# EAGLE design GrrCON-Badge-Rev1 (EAGLE 6.4)
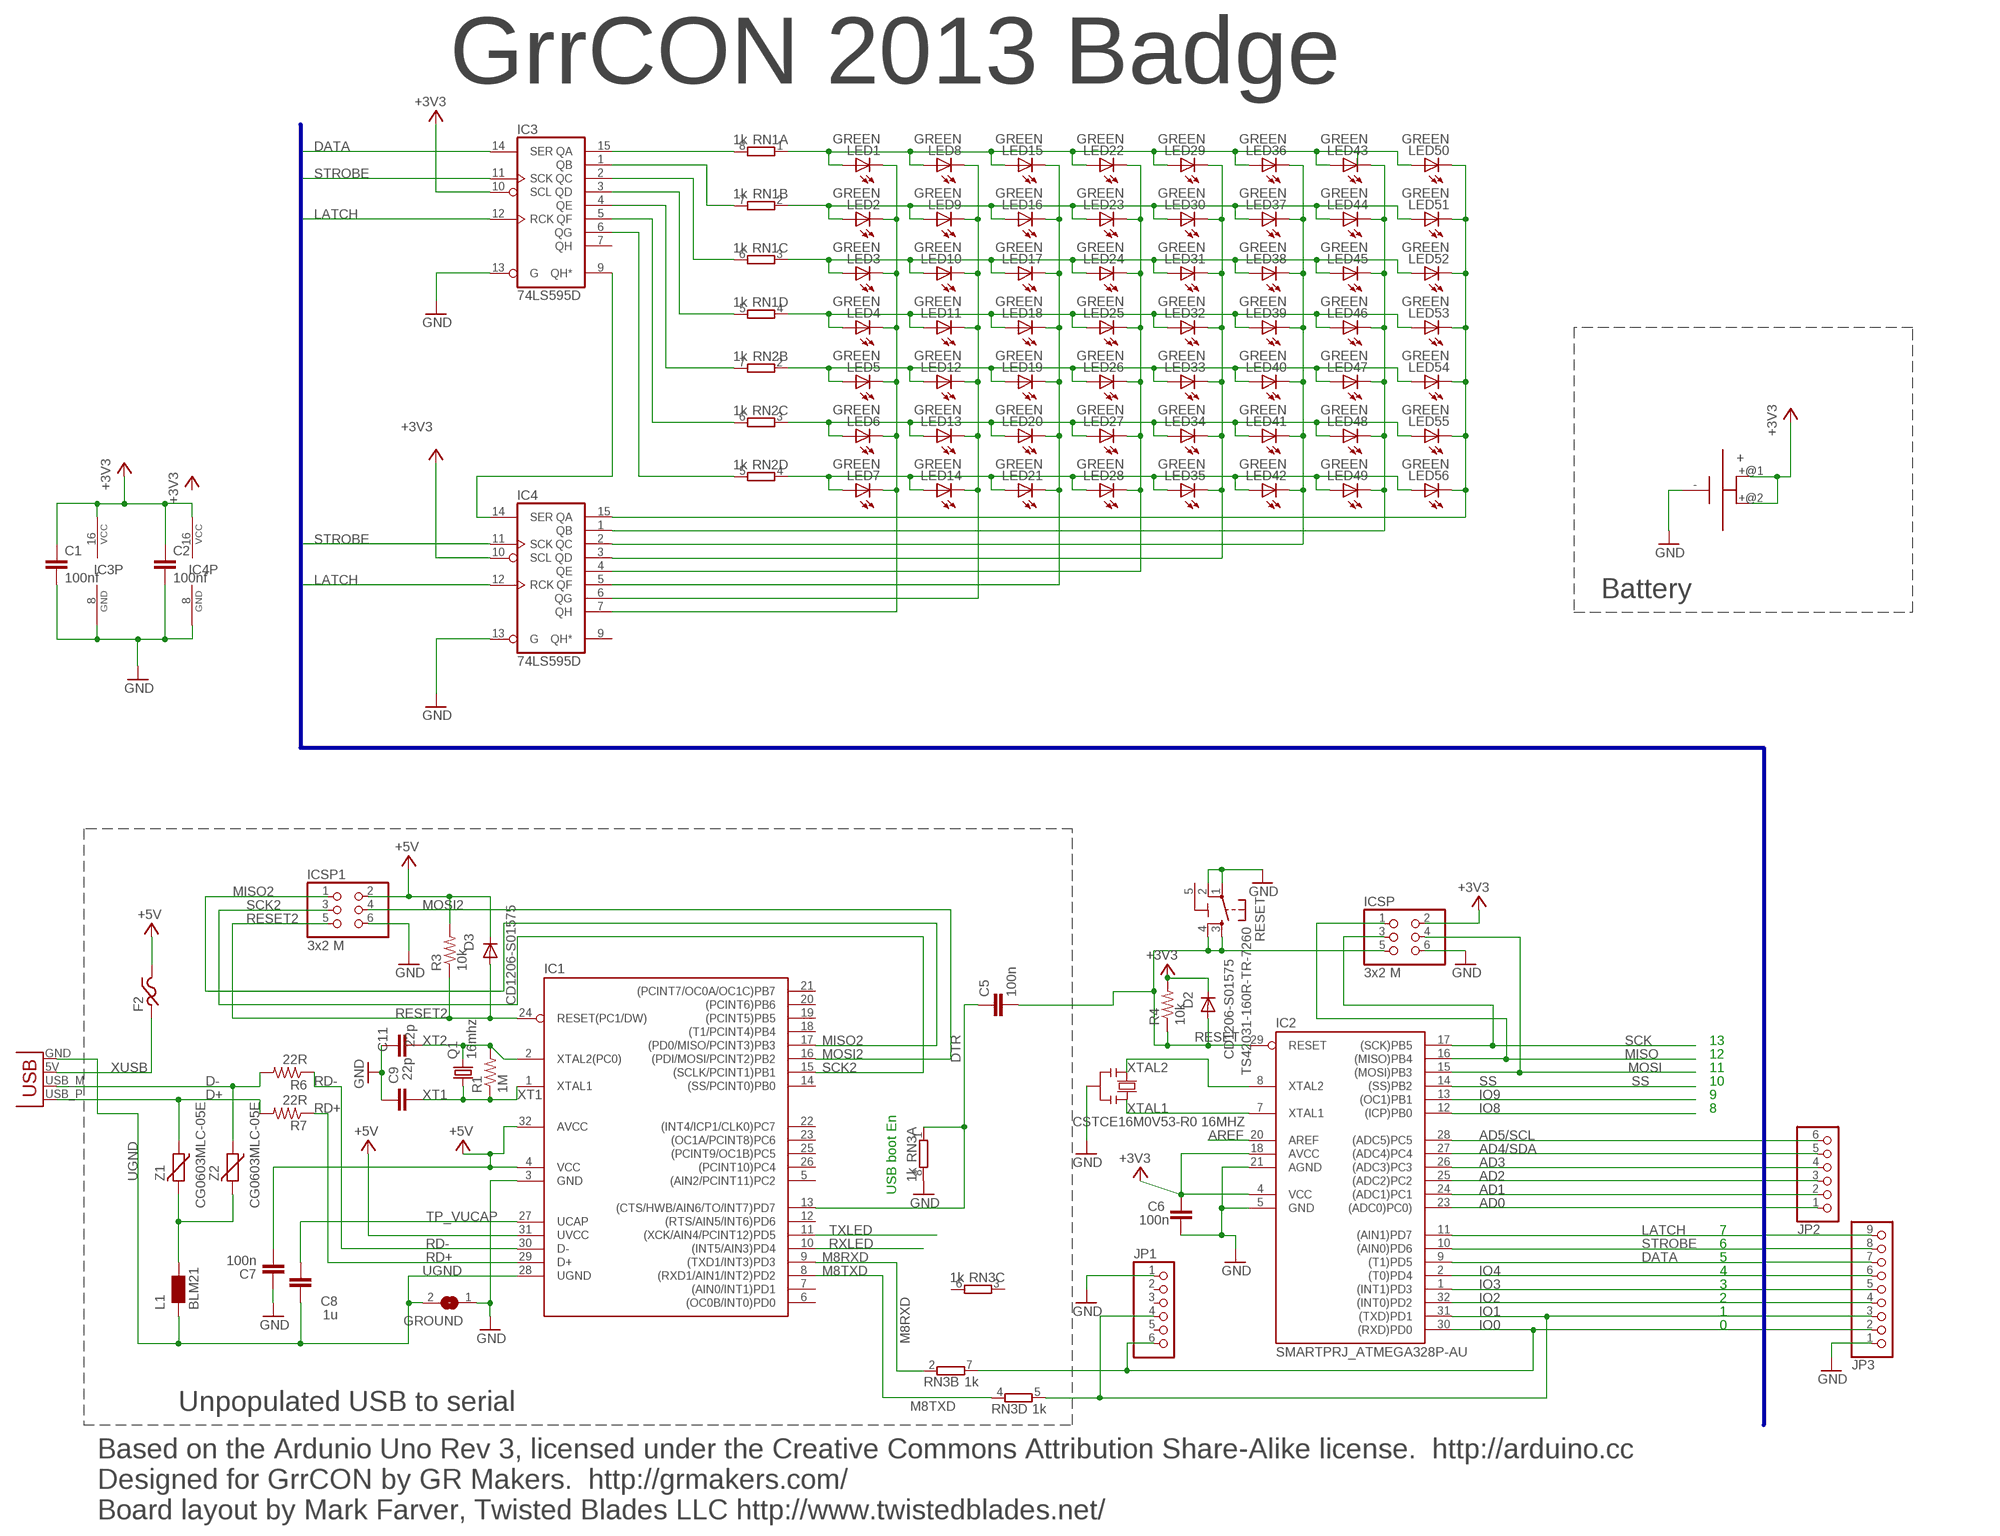
[diagram p0: schematic, sheet 1]

## Parts
C1  100nf  C-EUC0805  [C0805]
C2  100nf  C-EUC0805  [C0805]
C5  100n  C-EUC0805  [C0805]
C6  100n  C-EUC0805  [C0805]
C7  100n  C-EUC0805  [C0805]
C8  1u  C-EUC0805  [C0805]
C9  22p  C-EUC0805  [C0805]
C11  22p  C-EUC0805  [C0805]
D2  CD1206-S01575  DIODE-MINIMELF  [MINIMELF]
D3  CD1206-S01575  DIODE-MINIMELF  [MINIMELF]
F2  PTC-FUSE-US1206  [F1206]
GROUND  SJ  [SJ]
IC1  ATMEGA16U2AU  [SMARTPRJ_TQFP32-08]
IC2  SMARTPRJ_ATMEGA328P-AU  [SMARTPRJ_TQFP32-08]
IC3  74LS595D  [SO16]
IC4  74LS595D  [SO16]
ICSP  3x2 M  PINHD-2X3  [2X03]
ICSP1  3x2 M  PINHD-2X3  [2X03]
JP1  PINHD-1X6  [1X06]
JP2  PINHD-1X6  [1X06]
JP3  PINHD-1X9  [1X09]
L1  BLM21  WE-CBF_0805  [0805]
LED1  GREEN  LEDCHIP-LED0805  [CHIP-LED0805]
LED2  GREEN  LEDCHIP-LED0805  [CHIP-LED0805]
LED3  GREEN  LEDCHIP-LED0805  [CHIP-LED0805]
LED4  GREEN  LEDCHIP-LED0805  [CHIP-LED0805]
LED5  GREEN  LEDCHIP-LED0805  [CHIP-LED0805]
LED6  GREEN  LEDCHIP-LED0805  [CHIP-LED0805]
LED7  GREEN  LEDCHIP-LED0805  [CHIP-LED0805]
LED8  GREEN  LEDCHIP-LED0805  [CHIP-LED0805]
LED9  GREEN  LEDCHIP-LED0805  [CHIP-LED0805]
LED10  GREEN  LEDCHIP-LED0805  [CHIP-LED0805]
LED11  GREEN  LEDCHIP-LED0805  [CHIP-LED0805]
LED12  GREEN  LEDCHIP-LED0805  [CHIP-LED0805]
LED13  GREEN  LEDCHIP-LED0805  [CHIP-LED0805]
LED14  GREEN  LEDCHIP-LED0805  [CHIP-LED0805]
LED15  GREEN  LEDCHIP-LED0805  [CHIP-LED0805]
LED16  GREEN  LEDCHIP-LED0805  [CHIP-LED0805]
LED17  GREEN  LEDCHIP-LED0805  [CHIP-LED0805]
LED18  GREEN  LEDCHIP-LED0805  [CHIP-LED0805]
LED19  GREEN  LEDCHIP-LED0805  [CHIP-LED0805]
LED20  GREEN  LEDCHIP-LED0805  [CHIP-LED0805]
LED21  GREEN  LEDCHIP-LED0805  [CHIP-LED0805]
LED22  GREEN  LEDCHIP-LED0805  [CHIP-LED0805]
LED23  GREEN  LEDCHIP-LED0805  [CHIP-LED0805]
LED24  GREEN  LEDCHIP-LED0805  [CHIP-LED0805]
LED25  GREEN  LEDCHIP-LED0805  [CHIP-LED0805]
LED26  GREEN  LEDCHIP-LED0805  [CHIP-LED0805]
LED27  GREEN  LEDCHIP-LED0805  [CHIP-LED0805]
LED28  GREEN  LEDCHIP-LED0805  [CHIP-LED0805]
LED29  GREEN  LEDCHIP-LED0805  [CHIP-LED0805]
LED30  GREEN  LEDCHIP-LED0805  [CHIP-LED0805]
LED31  GREEN  LEDCHIP-LED0805  [CHIP-LED0805]
LED32  GREEN  LEDCHIP-LED0805  [CHIP-LED0805]
LED33  GREEN  LEDCHIP-LED0805  [CHIP-LED0805]
LED34  GREEN  LEDCHIP-LED0805  [CHIP-LED0805]
LED35  GREEN  LEDCHIP-LED0805  [CHIP-LED0805]
LED36  GREEN  LEDCHIP-LED0805  [CHIP-LED0805]
LED37  GREEN  LEDCHIP-LED0805  [CHIP-LED0805]
LED38  GREEN  LEDCHIP-LED0805  [CHIP-LED0805]
LED39  GREEN  LEDCHIP-LED0805  [CHIP-LED0805]
LED40  GREEN  LEDCHIP-LED0805  [CHIP-LED0805]
LED41  GREEN  LEDCHIP-LED0805  [CHIP-LED0805]
LED42  GREEN  LEDCHIP-LED0805  [CHIP-LED0805]
LED43  GREEN  LEDCHIP-LED0805  [CHIP-LED0805]
LED44  GREEN  LEDCHIP-LED0805  [CHIP-LED0805]
LED45  GREEN  LEDCHIP-LED0805  [CHIP-LED0805]
LED46  GREEN  LEDCHIP-LED0805  [CHIP-LED0805]
LED47  GREEN  LEDCHIP-LED0805  [CHIP-LED0805]
LED48  GREEN  LEDCHIP-LED0805  [CHIP-LED0805]
LED49  GREEN  LEDCHIP-LED0805  [CHIP-LED0805]
LED50  GREEN  LEDCHIP-LED0805  [CHIP-LED0805]
LED51  GREEN  LEDCHIP-LED0805  [CHIP-LED0805]
LED52  GREEN  LEDCHIP-LED0805  [CHIP-LED0805]
LED53  GREEN  LEDCHIP-LED0805  [CHIP-LED0805]
LED54  GREEN  LEDCHIP-LED0805  [CHIP-LED0805]
LED55  GREEN  LEDCHIP-LED0805  [CHIP-LED0805]
LED56  GREEN  LEDCHIP-LED0805  [CHIP-LED0805]
Q1  16mhz  CRYSTALSM49  [SM49]
R1  1M  R-US_R0805  [R0805]
R3  10k  R-US_R0805  [R0805]
R4  10k  R-US_R0805  [R0805]
R6  22R  R-US_R0805  [R0805]
R7  22R  R-US_R0805  [R0805]
RESET  TS42031-160R-TR-7260  TS42  [TS42]
RN1  1k  RESISTOR-DIL_4R-NCAY16  [RESISTOR-DIL_CAY16]
RN2  1k  RESISTOR-DIL_4R-NCAY16  [RESISTOR-DIL_CAY16]
RN3  1k  RESISTOR-DIL_4R-NCAY16  [RESISTOR-DIL_CAY16]
U$1  KEYSTONE_COIN2450  [3009]
X1  USBPCB  [USB-A-PCB]
Y2  CSTCE16M0V53-R0 16MHZ  RESONATORMU  [RESONATOR]
Z1  CG0603MLC-05E  VARISTORCN0603  [CT/CN0603]
Z2  CG0603MLC-05E  VARISTORCN0603  [CT/CN0603]

## Nets
+3V3: C1.1 C2.1 D2.C IC3.10(SCL) IC3.16(VCC) IC4.10(SCL) IC4.16(VCC) ICSP.2 R4.2 U$1.+@1(+) U$1.+@2(+)
+3V# [usbvcc]: C6.2 IC2.4(VCC) IC2.18(AVCC) ; supply symbol labelled +3V3
+5V [usbvcc]: C7.1 D3.C F2.2 IC1.4(VCC) IC1.31(UVCC) IC1.32(AVCC) ICSP1.2 R3.2
AD0: IC2.23((ADC0)PC0)) JP2.1
AD1: IC2.24((ADC1)PC1) JP2.2
AD2: IC2.25((ADC2)PC2) JP2.3
AD3: IC2.26((ADC3)PC3) JP2.4
AD4/SDA: IC2.27((ADC4)PC4) JP2.5
AD5/SCL: IC2.28((ADC5)PC5) JP2.6
AREF [aref]: IC2.20(AREF)
D+: R7.2 X1.USB_P(D+) Z1.1
D-: R6.2 X1.USB_M(D-) Z2.1
DATA: IC2.9((T1)PD5) IC3.14(SER) JP3.7
DTR: C5.1 IC1.13((CTS/HWB/AIN6/TO/INT7)PD7) RN3.1
GND [gnd]: C1.2 C2.2 C6.1 C7.2 C9.2 C11.2 GROUND.1 IC1.3(GND) IC2.5(GND) IC2.21(AGND) IC3.8(GND) IC3.13(G) IC4.8(GND) IC4.13(G) ICSP1.6 ICSP.6 JP1.1 JP3.1 RESET.1 RESET.2 RN3.8 U$1.- Y2.2
IO0: IC2.30((RXD)PD0) JP1.6 JP3.2 RN3.7
IO1: IC2.31((TXD)PD1) JP1.4 JP3.3 RN3.5
IO2: IC2.32((INT0)PD2) JP3.4
IO3: IC2.1((INT1)PD3) JP3.5
IO4: IC2.2((T0)PD4) JP3.6
IO8: IC2.12((ICP)PB0)
IO9: IC2.13((OC1)PB1)
LATCH: IC2.11((AIN1)PD7) IC3.12(RCK) IC4.12(RCK) JP3.9
M8RXD: IC1.9((TXD1/INT3)PD3) RN3.2
M8TXD: IC1.8((RXD1/AIN1/INT2)PD2) RN3.4
MISO: IC2.16((MISO)PB4) ICSP.1
MISO2: IC1.17((PD0/MISO/PCINT3)PB3) ICSP1.1
MOSI: IC2.15((MOSI)PB3) ICSP.4
MOSI2: IC1.16((PDI/MOSI/PCINT2)PB2) ICSP1.4
N$1: IC4.7(QH) LED1.C LED2.C LED3.C LED4.C LED5.C LED6.C LED7.C
N$2: LED2.A LED9.A LED16.A LED23.A LED30.A LED37.A LED44.A LED51.A RN1.2
N$3: IC3.6(QG) RN2.5
N$4: LED3.A LED10.A LED17.A LED24.A LED31.A LED38.A LED45.A LED52.A RN1.3
N$5: LED4.A LED11.A LED18.A LED25.A LED32.A LED39.A LED46.A LED53.A RN1.4
N$6: IC3.9(QH*) IC4.14(SER)
N$7: IC3.5(QF) RN2.6
N$8: IC3.4(QE) RN2.7
N$9: IC3.3(QD) RN1.5
N$10: IC4.6(QG) LED8.C LED9.C LED10.C LED11.C LED12.C LED13.C LED14.C
N$11: IC3.2(QC) RN1.6
N$12: IC3.1(QB) RN1.7
N$13: IC3.15(QA) RN1.8
N$18: IC4.5(QF) LED15.C LED16.C LED17.C LED18.C LED19.C LED20.C LED21.C
N$26: IC4.4(QE) LED22.C LED23.C LED24.C LED25.C LED26.C LED27.C LED28.C
N$34: IC4.3(QD) LED29.C LED30.C LED31.C LED32.C LED33.C LED34.C LED35.C
N$44: IC4.2(QC) LED36.C LED37.C LED38.C LED39.C LED40.C LED41.C LED42.C
N$52: IC4.1(QB) LED43.C LED44.C LED45.C LED46.C LED47.C LED48.C LED49.C
N$60: IC4.15(QA) LED50.C LED51.C LED52.C LED53.C LED54.C LED55.C LED56.C
N$64: LED5.A LED12.A LED19.A LED26.A LED33.A LED40.A LED47.A LED54.A RN2.2
N$65: LED6.A LED13.A LED20.A LED27.A LED34.A LED41.A LED48.A LED55.A RN2.3
N$66: LED7.A LED14.A LED21.A LED28.A LED35.A LED42.A LED49.A LED56.A RN2.4
N$67: LED1.A LED8.A LED15.A LED22.A LED29.A LED36.A LED43.A LED50.A RN1.1
RD+: IC1.29(D+) R7.1
RD-: IC1.30(D-) R6.1
RESET: C5.2 D2.A IC2.29(RESET) ICSP.5 R4.1 RESET.3 RESET.4
RESET2: D3.A IC1.24(RESET(PC1/DW)) ICSP1.5 R3.1
RXLED: IC1.10((INT5/AIN3)PD4)
SCK: IC2.17((SCK)PB5) ICSP.3
SCK2: IC1.15((SCLK/PCINT1)PB1) ICSP1.3
SS: IC2.14((SS)PB2)
STROBE: IC2.10((AIN0)PD6) IC3.11(SCK) IC4.11(SCK) JP3.8
TP_VUCAP: C8.1 IC1.27(UCAP)
TXLED: IC1.11((XCK/AIN4/PCINT12)PD5)
UGND [gnd]: C8.2 GROUND.2 IC1.28(UGND) L1.1 X1.GND
USHIELD [gnd]: L1.2 Z1.2 Z2.2
XT1: C9.1 IC1.1(XTAL1) Q1.1 R1.1
XT2: C11.1 IC1.2(XTAL2(PC0)) Q1.2 R1.2
XTAL1: IC2.7(XTAL1) Y2.3
XTAL2: IC2.8(XTAL2) Y2.1
XUSB [usbvcc]: F2.1 X1.5V(VBUS)
Unconnected: IC1.5((AIN2/PCINT11)PC2) IC1.6((OC0B/INT0)PD0) IC1.7((AIN0/INT1)PD1) IC1.12((RTS/AIN5/INT6)PD6) IC1.14((SS/PCINT0)PB0) IC1.18((T1/PCINT4)PB4) IC1.19((PCINT5)PB5) IC1.20((PCINT6)PB6) IC1.21((PCINT7/OC0A/OC1C)PB7) IC1.22((INT4/ICP1/CLK0)PC7) IC1.23((OC1A/PCINT8)PC6) IC1.25((PCINT9/OC1B)PC5) IC1.26((PCINT10)PC4) IC3.7(QH) IC4.9(QH*) JP1.2 JP1.3 JP1.5 RN2.1 RN2.8 RN3.3 RN3.6

## Buses
DATA,STROBE,LATCH

## Notes on the sheet
- GrrCON 2013 Badge
- Battery
- 13
- 12
- 11
- 10
- 9
- 8
- USB boot En
- 7
- 6
- 5
- 4
- 3
- 2
- 1
- 0
- Unpopulated USB to serial
- Based on the Ardunio Uno Rev 3, licensed under the Creative Commons Attribution Share-Alike license.  http://arduino.cc
  Designed for GrrCON by GR Makers.  http://grmakers.com/
  Board layout by Mark Farver, Twisted Blades LLC http://www.twistedblades.net/

## Power pins joined to a net without a drawn wire
5-GND: RESET.5(5-GND)

## Library data of the parts
C1 C2 C5-C9 C11 = C_rcl:C-EU: CAPACITOR, European symbol
D2 D3 = diode:DIODE-: DIODE
F2 = C_REVOLT:PTC-FUSE-US
GROUND = jumper:SJ: SMD solder JUMPER
IC1 = C_arduino_Uno_Rev3-02-TH:ATMEGA16U2
IC2 = C_arduino_Uno_Rev3-02-TH:SMARTPRJ_ATMEGA328P-: MICROCONTROLLER 4 Kbytes FLASH 128 bytes SRAM 256 bytes EEPROM UART 6-channel 10 bit ADC
IC3 IC4 = 74xx-us:74*595: 8-bit SHIFT REGISTER, output latch
ICSP ICSP1 = SmartPrj:PINHD-2X3: PIN HEADER
JP1 JP2 = pinhead:PINHD-1X6: PIN HEADER
JP3 = pinhead:PINHD-1X9: PIN HEADER
L1 = wuerth-elektronik:WE-CBF: SMD EMI Suppression Ferrite Beads - excellent anti-EMI properties - low DCR - impedances till 3000 ohms - rated current up to 6 A
LED1-LED56 = led:LED: LED OSRAM: - CHIPLED LG R971, LG N971, LY N971, LG Q971, LY Q971, LO R971, LY R971 LH N974, LH R974 LS Q976, LO Q976, LY Q976 LO Q996 - Hyper CHIPLED LW Q18S LB Q993, LB Q99A, LB R99A - SideLED LS A670, LO A670, LY A670, LG A670, LP A670 LB A673, LV A673, LT A673, LW A673 LH A674 LY A675 LS A676, LA A676, LO A676, LY A676, LW A676 LS A679, LY A679, LG A679 - Hyper Micro SIDELED® LS Y876, LA Y876, LO Y876, LY Y876 LT Y87S - SmartLED LW L88C, LW L88S LB L89C, LB L89S, LG L890 LS L89K, LO L89K, LY L89K LS L896, LA L896, LO L896, LY L896 - TOPLED LS T670, LO T670, LY T670, LG T670, LP T670 LSG T670, LSP T670, LSY T670, LOP T670, LYG T670 LG T671, LOG T671, LSG T671 LB T673, LV T673, LT T673, LW T673 LH T674 LS T676, LA T676, LO T676, LY T676, LB T676, LH T676, LSB T676, LW T676 LB T67C, LV T67C, LT T67C, LS T67K, LO T67K, LY T67K, LW E67C LS E67B, LA E67B, LO E67B, LY E67B, LB E67C, LV E67C, LT E67C LW T67C LS T679, LY T679, LG T679 LS T770, LO T770, LY T770, LG T770, LP T770 LB T773, LV T773, LT T773, LW T773 LH T774 LS E675, LA E675, LY E675, LS T675 LS T776, LA T776, LO T776, LY T776, LB T776 LHGB T686 LT T68C, LB T68C - Hyper Mini TOPLED® LB M676 - Mini TOPLED Santana® LG M470 LS M47K, LO M47K, LY M47K Source: http://www.osram.convergy.de LUXEON: - LUMILED® LXK2-PW12-R00, LXK2-PW12-S00, LXK2-PW14-U00, LXK2-PW14-V00 LXK2-PM12-R00, LXK2-PM12-S00, LXK2-PM14-U00 LXK2-PE12-Q00, LXK2-PE12-R00, LXK2-PE12-S00, LXK2-PE14-T00, LXK2-PE14-U00 LXK2-PB12-K00, LXK2-PB12-L00, LXK2-PB12-M00, LXK2-PB14-N00, LXK2-PB14-P00, LXK2-PB14-Q00 LXK2-PR12-L00, LXK2-PR12-M00, LXK2-PR14-Q00, LXK2-PR14-R00 LXK2-PD12-Q00, LXK2-PD12-R00, LXK2-PD12-S00 LXK2-PH12-R00, LXK2-PH12-S00 LXK2-PL12-P00, LXK2-PL12-Q00, LXK2-PL12-R00 Source: www.luxeon.com KINGBRIGHT: KA-3528ASYC Source: www.kingbright.com
Q1 = crystal:CRYSTAL: CRYSTAL; OC_FARNELL: unknown; OC_NEWARK: unknown
R1 R3 R4 R6 R7 = C_rcl:R-US_: RESISTOR, American symbol
RESET = SmartPrj:TS42: TS42 Dongnan Electronics Tact switch VDC 12V - 50mA
RN1-RN3 = C_arduino_Uno_Rev3-02-TH:RESISTOR-DIL_4R-N: Array Chip Resistor Source: RS Component / Phycomp
U$1 = C_arduino_Uno_Rev3-02-TH:KEYSTONE_COIN: Keystone Coin Cell Holders http://www.mouser.com/ds/2/215/M60p7-29726.pdf
X1 = SparkFun:USB: USB Connectors USB-B-PTH is fully proven SKU : PRT-00139 USB-miniB is fully proven SKU : PRT-00587 USB-A-PCB is untested. USB-A-H is throughly reviewed, but untested. Spark Fun Electronics SKU : PRT-00437 USB-B-SMT is throughly reviewed, but untested. Needs silkscreen touching up. USB-A-S has not been used/tested USB-MB-H has not been used/tested
Y2 = SmartPrj:RESONATOR
Z1 Z2 = varistor:VARISTOR: VARISTOR

## Net classes
0 default: width 0.254 mm, clearance 0.254 mm
1 power: width 0.61 mm, drill 0.61 mm, clearance 0.254 mm
2 gnd: width 0.305 mm, drill 0.559 mm, clearance 0.254 mm
3 usbvcc: width 0.508 mm, drill 0.61 mm, clearance 0.254 mm
4 aref: width 0.406 mm, drill 0.61 mm, clearance 0.254 mm

## Board
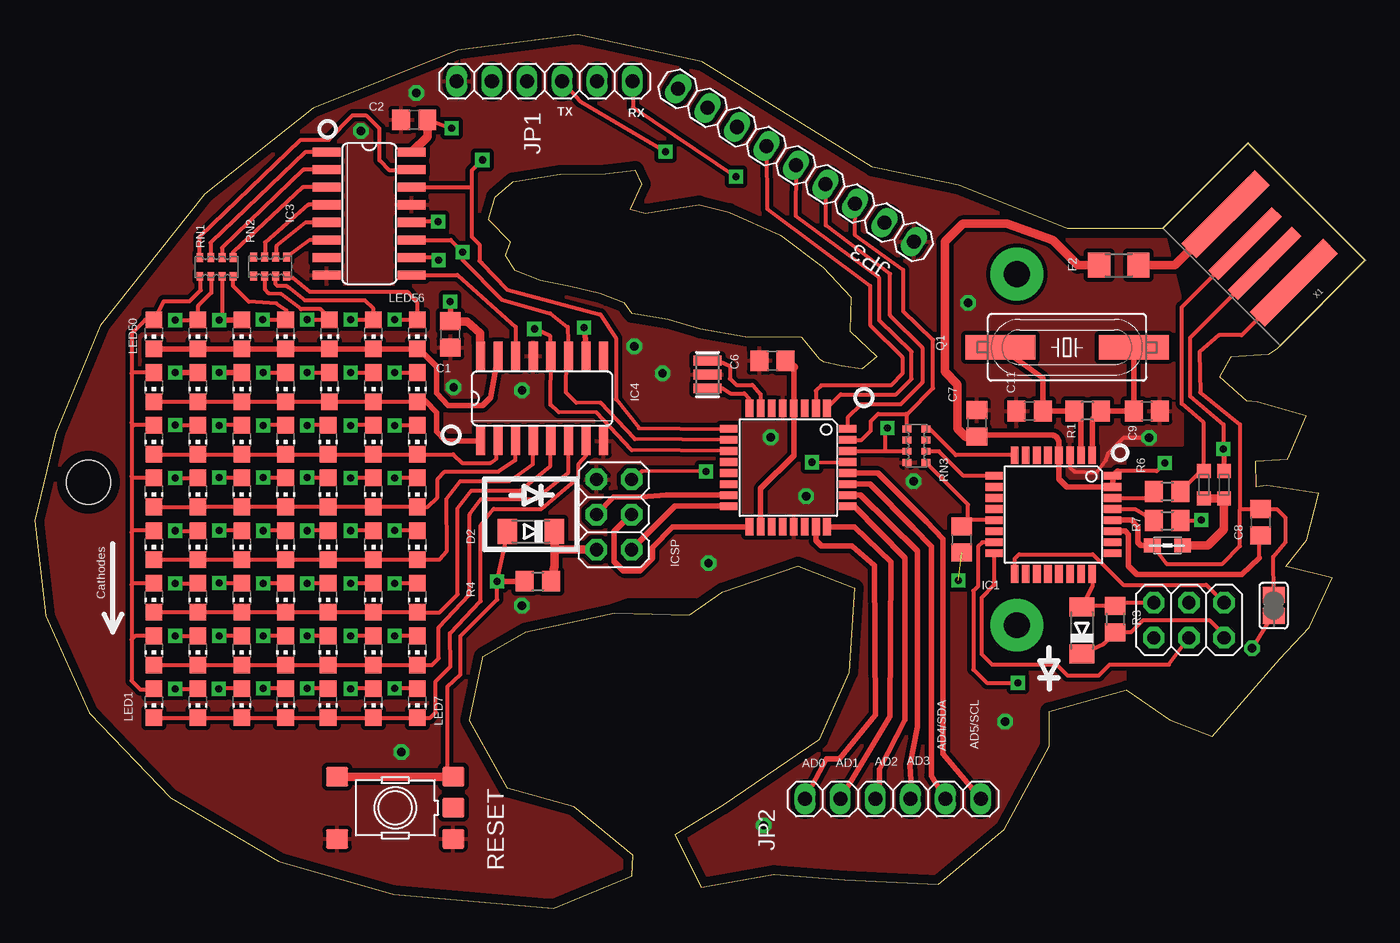
[diagram p1: board, top side]
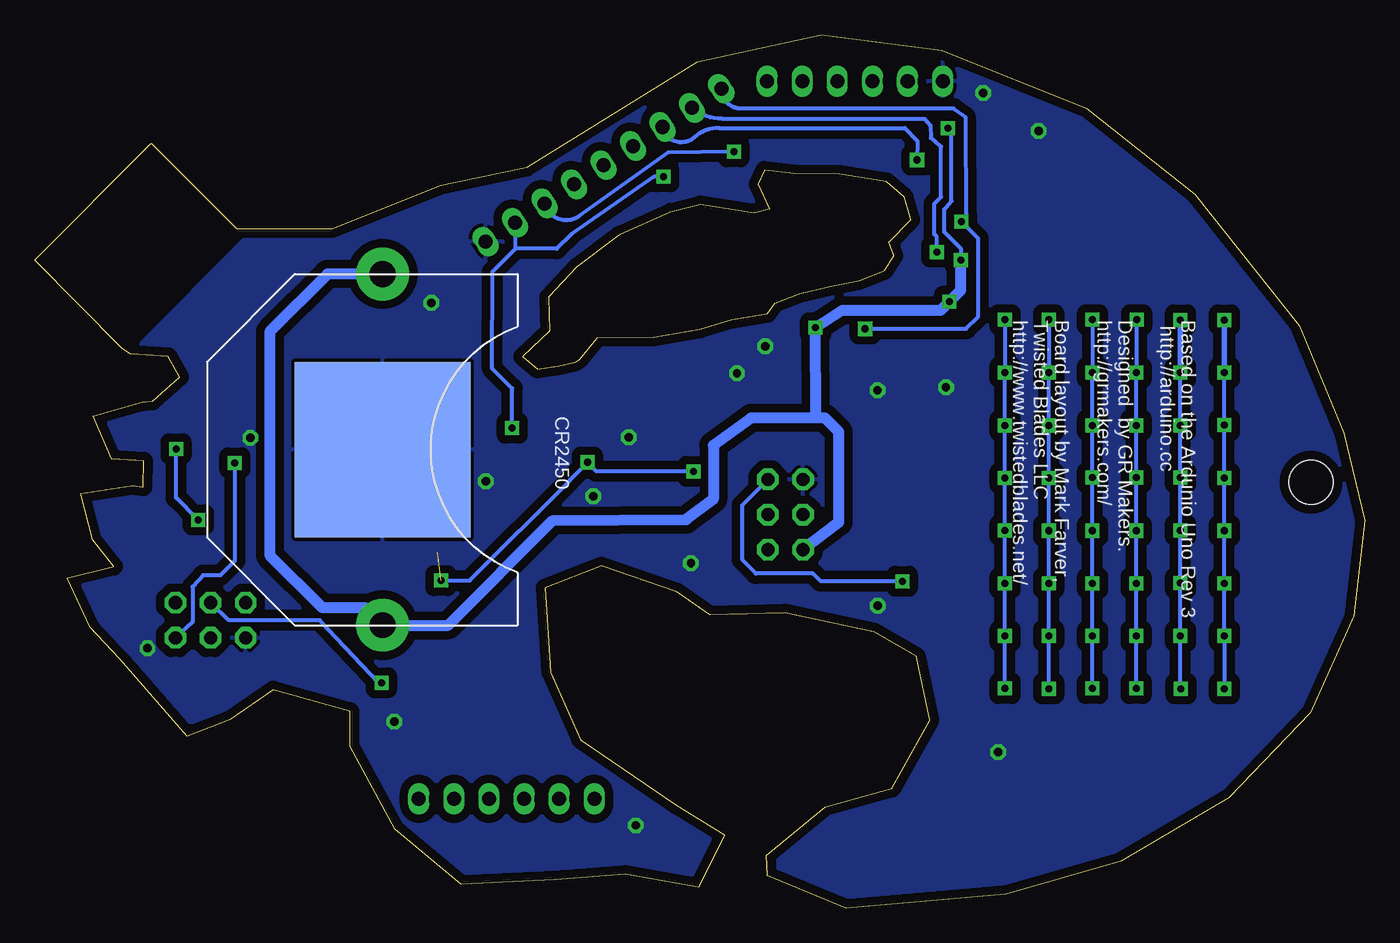
[diagram p2: board, bottom side, seen from below]

Size 96.22 x 63.2 mm. Coordinates in mm from the lower left corner, seen from the top.
Outline: 40.89,44.45 38.76,44.96 36.6,45.39 34.75,46.13 34.06,47.19 34.44,48.18 32.84,49.81 33.3,51.44 34.62,52.55 38,53.11 41.3,53.14 43.43,53.39 43.89,52.37 43.05,50.57 44.2,50.27 48.06,50.9 50.22,50.37 53.95,48.69 57.02,46.38 59.03,44.22 58.98,41.73 60.91,39.9 59.84,38.99 58.37,39.22 57.07,39.5 56.79,39.7 55.5,41.28 51.41,41.3 48.11,41.88 45.82,42.57 43.2,43 42.67,43.76 40.89,44.45
Outline: 43.28,3.84 39.01,7.34 34.21,8.69 31.45,13.59 32.44,18.21 35.51,19.99 41.96,21.36 47.37,21.21 49.76,22.89 55.22,24.74 59.28,23.16 58.9,17.07 56.74,12.17 49.78,7.44 46.3,5.31 48.21,1.52 53.49,2.46 58.62,2.06 65.38,1.73 70.16,5.69 73.41,11.71 73.38,14.22 78.94,15.8 82.12,13.64 85.17,12.45 90.07,18.03 92.2,20.29 93.85,23.88 90.47,24.71 92.02,26.62 92.86,30 89.1,30.58 88.37,30.48 88.32,32.36 90.63,32.49 91.97,35.59 88.42,36.63 87.66,36.68 85.72,38.43 86.56,39.9 89.26,40.08 89.89,40.49 96.22,46.86 87.78,55.32 81.58,49.17 74.7,49.15 66.8,52.3 60.6,53.59 48.28,61.21 39.32,63.2 30.61,62.08 20.14,57.89 12.29,51.64 4.75,42.14 1.52,34.37 0,28.04 0.81,21.13 3.94,14.12 9.86,7.98 17.65,3.4 25.96,0.99 37.54,0 43.2,2.34 43.28,3.84
Copper layers (1*16): Top 0.035mm / dielectric 1.5mm / Bottom 0.035mm
Design rules "default": minimum track width 10mil, minimum drill 22mil, track to track 10mil, track to pad 10mil, pad to pad 10mil, via to via 12mil, smd to smd 8mil, copper to edge 26mil, drill to drill 12mil, minimum pad ring 10mil, minimum via ring 10mil, stop-mask expansion 1mil, vias tented up to drill 30mil, thermal gap 10mil
Holes 3.2 mm at 3.89,30.81

### Footprints (pad centres in the part's own frame; a part is rotated, then mirrored left to right if it is on the bottom)
C0805 = smd 1.3 x 1.5: 1 -0.95,0; 2 0.95,0
MINIMELF = smd 1.4 x 1.8: A 1.7,0; C -1.7,0
F1206 = smd 1.6 x 1.803: 1 -1.422,0; 2 1.422,0
SJ = smd 1.168 x 1.6: 1 -0.762,0; 2 0.762,0
SMARTPRJ_TQFP32-08 = smd 1.27 x 0.559: 1 -4.293,2.8; 2 -4.293,2; 3 -4.293,1.2; 4 -4.293,0.4; 5 -4.293,-0.4; 6 -4.293,-1.2; 7 -4.293,-2; 8 -4.293,-2.8; 17 4.293,-2.8; 18 4.293,-2; 19 4.293,-1.2; 20 4.293,-0.4; 21 4.293,0.4; 22 4.293,1.2; 23 4.293,2; 24 4.293,2.8 | smd 0.559 x 1.27: 9 -2.8,-4.293; 10 -2,-4.293; 11 -1.2,-4.293; 12 -0.4,-4.293; 13 0.4,-4.293; 14 1.2,-4.293; 15 2,-4.293; 16 2.8,-4.293; 25 2.8,4.293; 26 2,4.293; 27 1.2,4.293; 28 0.4,4.293; 29 -0.4,4.293; 30 -1.2,4.293; 31 -2,4.293; 32 -2.8,4.293
SO16 = smd 0.66 x 2.032: 1 -4.445,-3.073; 2 -3.175,-3.073; 3 -1.905,-3.073; 4 -0.635,-3.073; 5 0.635,-3.073; 6 1.905,-3.073; 7 3.175,-3.073; 8 4.445,-3.073; 9 4.445,3.073; 10 3.175,3.073; 11 1.905,3.073; 12 0.635,3.073; 13 -0.635,3.073; 14 -1.905,3.073; 15 -3.175,3.073; 16 -4.445,3.073
2X03 = drill 0.95 pad 1.55 octagon: 1 -2.54,-1.27; 2 -2.54,1.27; 3 0,-1.27; 4 0,1.27; 5 2.54,-1.27; 6 2.54,1.27
1X06 = drill 1.016 long: 1 -6.35,0; 2 -3.81,0; 3 -1.27,0; 4 1.27,0; 5 3.81,0; 6 6.35,0
1X09 = drill 1.016 long: 1 -10.16,0; 2 -7.62,0; 3 -5.08,0; 4 -2.54,0; 5 0,0; 6 2.54,0; 7 5.08,0; 8 7.62,0; 9 10.16,0
0805 = smd 1.2 x 1: 1 -1.1,0; 2 1.1,0
CHIP-LED0805 = smd 1.2 x 1.2: A 0,-1.05; C 0,1.05
SM49 = smd 5.08 x 1.778: 1 -4.826,0; 2 4.826,0
R0805 = smd 1.3 x 1.5: 1 -0.95,0; 2 0.95,0
TS42 = smd 1.6 x 1.4: 1 -4.2,2.25; 2 4.2,2.25; 3 -4.2,-2.25; 4 4.2,-2.25; 5 -4.2,0
RESISTOR-DIL_CAY16 = smd 0.5 x 0.65: 1 -1.2,-0.675; 2 -0.4,-0.675; 3 0.4,-0.675; 4 1.2,-0.675; 5 1.2,0.675; 6 0.4,0.675; 7 -0.4,0.675; 8 -1.2,0.675
3009 = drill 1.854 pad 3.81: +@1 -12.7,0; +@2 12.7,0 | smd 12.7 x 12.7: - 0,0
USB-A-PCB = smd 7.5 x 1.5: 5V -0.2,-3.5; GND -0.2,3.5 | smd 6.5 x 1: USB_M 0.3,-1; USB_P 0.3,1
RESONATOR = smd 0.7 x 2: 1 -1,0; 2 0,0; 3 1,0
CT/CN0603 = smd 1 x 1: 1 -1,0; 2 1,0

### Placement (x,y rotation side)
C1  30.07,41.5 270 top
C2  27.46,57.02 180 top
C5  67.06,26.67 270 top
C6  53.37,39.6 0 top
C7  68.15,35.08 90 top
C8  88.67,27.91 90 top
C9  80.44,35.97 0 top
C11  71.96,35.97 180 top
D2  35.89,27.25 180 top
D3  75.74,20.09 90 top
F2  78.41,46.51 180 top
GROUND  89.61,21.89 90 top
IC1  73.69,28.47 270 top
IC2  54.51,31.88 270 top
IC3  24.21,50.24 270 top
IC4  36.7,36.88 0 top
ICSP  41.91,28.47 90 top
ICSP1  83.49,20.83 180 top
JP1  36.88,59.82 0 top
JP2  62.08,7.9 0 top
JP3  55.07,53.75 147 top
L1  81.94,26.24 0 top
LED1  8.64,14.83 180 top
LED2  11.81,14.83 180 top
LED3  14.99,14.83 180 top
LED4  18.16,14.83 180 top
LED5  21.23,14.83 180 top
LED6  24.51,14.83 180 top
LED7  27.69,14.83 180 top
LED8  8.64,18.64 180 top
LED9  11.81,18.64 180 top
LED10  14.99,18.64 180 top
LED11  18.16,18.64 180 top
LED12  21.23,18.64 180 top
LED13  24.51,18.64 180 top
LED14  27.69,18.64 180 top
LED15  8.64,22.45 180 top
LED16  11.81,22.45 180 top
LED17  14.99,22.45 180 top
LED18  18.16,22.45 180 top
LED19  21.23,22.45 180 top
LED20  24.51,22.45 180 top
LED21  27.69,22.45 180 top
LED22  8.64,26.26 180 top
LED23  11.81,26.26 180 top
LED24  14.99,26.26 180 top
LED25  18.16,26.26 180 top
LED26  21.23,26.26 180 top
LED27  24.51,26.26 180 top
LED28  27.69,26.26 180 top
LED29  8.64,30.07 180 top
LED30  11.81,30.07 180 top
LED31  14.99,30.07 180 top
LED32  18.16,30.07 180 top
LED33  21.23,30.07 180 top
LED34  24.51,30.07 180 top
LED35  27.69,30.07 180 top
LED36  8.64,33.88 180 top
LED37  11.81,33.88 180 top
LED38  14.99,33.88 180 top
LED39  18.16,33.88 180 top
LED40  21.23,33.88 180 top
LED41  24.51,33.88 180 top
LED42  27.69,33.88 180 top
LED43  8.64,37.69 180 top
LED44  11.81,37.69 180 top
LED45  14.99,37.69 180 top
LED46  18.16,37.69 180 top
LED47  21.34,37.69 180 top
LED48  24.51,37.69 180 top
LED49  27.69,37.69 180 top
LED50  8.64,41.5 180 top
LED51  11.81,41.5 180 top
LED52  14.99,41.5 180 top
LED53  18.16,41.5 180 top
LED54  21.34,41.5 180 top
LED55  24.51,41.5 180 top
LED56  27.69,41.5 180 top
Q1  74.68,40.56 180 top
R1  76.15,35.97 180 top
R3  78.16,20.9 270 top
R4  36.4,23.65 0 top
R6  81.92,30.15 0 top
R7  81.92,28.04 0 top
RESET  26.09,7.26 180 top
RN1  13.16,46.38 0 top
RN2  17.04,46.41 0 top
RN3  63.78,33.45 90 top
U$1  71.04,33.17 270 bottom
X1  88.47,47.57 225 top
Y2  48.67,38.61 90 top
Z1  86.03,30.63 270 top
Z2  84.56,30.63 270 top

### Tracks (layer width: path | path; a pad name or v marks a point on that pad's centre or on a via)
+3V3  (via drill 0.51)
  Top 0.305: 30.11,42.27 C1.1 | v29.23,46.89 29.06,47.07 IC3.10 | C2.1 v30.15,56.41 | IC4.10 39.98,39.98
  Top 0.406: 39.98,39.98 v39.73,41.99 | C1.1 30.07,43.87 v30.05,43.89
  Top 0.61: IC3.16 28.41,55.81 C2.1 | IC4.16 32.23,41.61 31.29,42.42 30.11,42.42 C1.1 | ICSP.2 37.59,25.93 | 37.59,25.93 D2.C | R4.2 37.59,24.74 37.59,25.93
  Bottom 0.305: v30.15,56.41 29.9,56.64 29.9,51.16 30.43,50.55 30.43,48.92 29.23,47.73 v29.23,46.89
  Bottom 0.813: ICSP.2 38.08,27.91 38.08,34.47 39.06,35.46 | v29.23,46.89 29.23,44.7 v30.05,43.89 30.68,43.26 37.77,43.26 v39.73,41.99 39.7,35.48 39.06,35.46 | U$1.+@1 75.03,45.87 79.2,41.71 79.2,25.53 75.41,21.74 72.31,21.74 U$1.+@2 66.29,20.47 58.74,28.03 49.09,28.11 47.12,29.59 47.12,33.48 44.37,35.46 39.06,35.46
+3V#
  Top 0.406: 54.91,39.14 IC2.4 54.91,32.76 52.51,30.36 IC2.18
  Top 0.61: 54.91,39.14 54.35,39.56 C6.2
+5V  (via drill 0.51)
  Top 0.305: ICSP1.2 86.03,19.79 85.01,20.8 80.14,20.8 79.3,19.96 R3.2 77.33,19.13 D3.C | v81.74,32.21 81.15,31.62 78.33,31.62
  Top 0.406: 74.09,31.06 74.08,31.06 | 74.08,31.06 IC1.4 74.08,33.64 arc90 73.48,34.24 68.19,34.24 | 74.08,31.06 74.68,30.47 IC1.31 IC1.32 78.33,31.62
  Top 0.61: 68.19,34.24 C7.1 68.11,34.09 67.36,34.09 66.75,34.7 66.75,37.9 65.84,38.81 65.84,48.21 67.13,49.5 70.33,49.5 73.64,48.31 75.44,46.51 F2.2
  Bottom 0.305: v81.74,32.21 81.74,25.12 82.78,24.08 84.02,24.08 84.78,23.24 84.78,20.73 ICSP1.2
AD0
  Top 0.406: IC2.23 56.51,26.6 56.92,26.19 59.13,26.19 60.76,24.79 60.81,14 58.22,10.82 57.28,10.82 JP2.1
AD1
  Top 0.406: IC2.24 59.28,27.58 61.92,25.04 61.87,13.87 JP2.2
AD2
  Top 0.406: JP2.3 61.11,8.97 61.11,10.03 62.94,13.64 62.94,25.35 59.26,29.08 IC2.25
AD3
  Top 0.406: 63.32,8.64 JP2.4 63.4,8.71 63.32,10.34 63.86,13.11 63.86,25.83 59.73,29.88 IC2.26
AD4/SDA
  Top 0.406: JP2.5 64.87,9.58 64.85,9.58 64.85,26.16 63.58,27.51 60.41,30.68 IC2.27
AD5/SCL
  Top 0.406: JP2.6 65.68,11.18 65.68,26.72 64.49,27.97 60.98,31.48 IC2.28
D+  (via drill 0.51)
  Top 0.305: X1.USB_P 83.57,41.26 83.57,37.03 85.98,34.99 v85.98,33.22 | v85.98,33.22 85.98,31.68 Z1.1 86.03,33.17 v85.98,33.22 | R7.2 84.33,28.04 v84.38,28.09
  Bottom 0.305: v84.38,28.09 85.98,29.69 v85.98,33.22
D-
  Top 0.305: X1.USB_M 82.96,43.48 82.96,36.5 84.56,35.13 Z2.1 84.35,31.63 R6.2
  Top 0.406: 82.87,30.16 R6.2
DATA  (via drill 0.51)
  Top 0.305: IC2.9 49.65,34.67 43.71,34.72 42.04,36.83 42.04,41.25 40.92,42.95 34.19,44.73 32.33,46.67 32.18,46.82 32.18,48.01 31.62,48.56 31.62,52.17 | IC3.14 31.6,52.15 31.62,52.17 | v32.38,54.13 31.62,53.37 31.62,52.17
  Bottom 0.305: v32.38,54.13 32.36,55.47 33.27,56.44 46.71,56.44 arc-42 48.51,55.75 arc120 JP3.7
DTR
  Top 0.305: IC1.13 67.51,28.07 | 67.51,28.07 arc90 C5.1 | 67.51,28.07 67.51,29.2 RN3.1
GND  (via drill 0.61)
  Top 0.305: IC1.3 74.89,31.9 75.21,31.57 76.81,31.52 77.5,32.39 77.65,32.89 78.79,34.04 v80.62,34.04 | GROUND.1 89.38,20.93 v88.06,18.8
  other vias: 30.3,37.67 23.6,56.21 26.52,11.3 35.26,37.47 53.24,34.06 55.8,29.79 52.73,5.99 27.61,58.98 45.42,38.68 43.38,40.64 35.23,21.89 70.21,13.49 48.74,24.97 67.51,43.79 63.58,30.89
  pour Top (isolate 0.305): 39.17,63.2 30.38,62.13 20.19,57.96 11.96,51.59 4.9,42.34 1.5,34.29 0.03,27.84 0.69,20.93 4.04,13.87 10.34,7.44 17.58,3.48 26.49,0.91 37.49,-0.03 43.13,2.34 43.31,3.94 38.96,7.37 34.67,8.71 31.55,13.67 32.38,18.14 35.31,19.94 42.9,22.61 48.31,22.56 50.95,23.04 55.7,24.84 59.31,23.22 59.13,16.87 56.59,12.14 46.53,5.36 48.29,1.4 53.7,2.54 65.43,1.68 70.21,5.82 73.41,11.68 73.53,14.3 78.84,15.77 78.87,33.53 83.01,33.53 83.03,43.46 81.58,49.15 75.01,48.97 66.5,52.4 60.73,53.49 48.08,61.26
  pour Bottom (isolate 0.61): 39.17,63.2 30.38,62.13 20.19,57.96 11.96,51.59 4.9,42.34 1.5,34.29 0.03,27.84 0.69,20.93 4.04,13.87 10.34,7.44 17.58,3.48 26.49,0.91 37.49,-0.03 43.13,2.34 43.31,3.94 38.96,7.37 34.67,8.71 31.45,13.56 32.28,18.14 35.23,19.94 41.73,21.21 44.7,21.03 47.75,21.13 49.33,22.71 49.33,22.73 55.35,24.76 59.16,23.32 59.18,17.12 56.59,12.14 46.53,5.36 48.29,1.4 53.7,2.54 65.43,1.68 70.21,5.82 73.41,11.71 73.51,14.25 78.77,15.8 82.19,13.51 85.19,12.5 92.05,19.99 93.93,23.88 90.5,24.54 92.05,26.42 93.04,29.97 88.82,30.58 88.29,30.48 88.24,32.36 90.63,32.92 91.85,35.69 88.62,36.63 87.68,36.8 85.95,38.38 86.59,39.95 89.15,40.18 80.39,49.05 74.63,49.25 66.5,52.4 60.58,53.59 48.11,61.26
IO0  (via drill 0.51)
  Top 0.305: IC2.30 61.5,33.08 | JP1.6 43.28,57.94 v50.72,52.91 | v61.67,34.72 61.5,34.55 61.5,33.08 | RN3.7 61.53,33.05 arc-90 61.5,33.08
  Bottom 0.305: v61.67,34.72 61.67,37.59 63.12,39.04 63.09,46.04 61.43,47.7 | v50.72,52.91 51.41,52.91 57.38,48.77 58.45,47.7 61.43,47.7 | 61.43,47.7 JP3.2
IO1  (via drill 0.51)
  Top 0.305: IC2.31 59.81,33.88 60.48,34.54 60.48,35.23 61.01,35.76 63.04,35.76 | 63.04,35.76 63.12,35.76 64.97,37.62 64.97,41.1 62.81,43.21 62.81,46.18 59.3,48.72 JP3.3 | JP1.4 39.47,58.34 v45.64,54.71 | RN3.5 63.1,35.7 arc90 63.04,35.76
  Bottom 0.305: v45.64,54.71 50.39,54.66 56.82,50.06 arc111 JP3.3
IO2
  Top 0.305: IC2.32 58.8,35.48 59.77,36.45 62.64,36.45 64.21,38.02 64.21,40.54 61.87,42.88 61.87,45.87 57.2,49.4 JP3.4
IO3
  Top 0.305: IC2.1 58.3,37.16 62.31,37.16 63.42,38.28 63.42,40.26 61.09,42.52 61.09,45.57 55.04,50.06 JP3.5
IO4
  Top 0.305: IC2.2 56.51,37.43 56.9,37.82 61.92,37.82 62.76,38.66 62.76,39.85 60.43,42.19 60.43,45.01 52.98,50.57 JP3.6
LATCH  (via drill 0.51)
  Top 0.305: IC2.11 43.17,33.13 40.64,35.86 37.9,35.89 37.31,36.42 IC4.12 37.31,41.38 v36.14,41.91 | v29.18,49.66 27.33,49.66 IC3.12
  Bottom 0.305: v36.14,41.91 28.85,41.91 27.96,42.8 27.96,48.44 v29.18,49.66 | 28.85,49.89 28.91,57.25 29.74,57.84 45.12,57.84 arc91 JP3.9
  Bottom 0.406: 28.85,49.89 v29.18,49.66
M8RXD
  Top 0.305: IC1.9 67.18,31.27 65.41,33.05 RN3.2
M8TXD
  Top 0.305: IC1.8 66.62,32.77 64.74,34.65 RN3.4
MISO
  Top 0.406: IC2.16 46.32,29.08 ICSP.1
MISO2
  Top 0.305: IC1.17 70.89,25.29 71.2,25.6 76.53,25.6 78.74,23.39 84.73,23.39 ICSP1.1
MOSI
  Top 0.406: IC2.15 45.7,29.88 43.87,29.74 41.86,29.74 ICSP.4
MOSI2
  Top 0.305: IC1.16 69.39,23.37 68.48,22.45 68.48,18.39 69.24,17.63 73.91,17.63 74.7,16.84 76.96,16.84 77.75,17.63 82.04,17.63 ICSP1.4
N$1
  Top 0.305: LED1.C LED2.C LED3.C LED4.C LED5.C LED6.C LED7.C 28.62,13.78 29.01,14.17 29.01,16.41 30.07,17.48 30.05,19.89 32.26,22.23 32.26,27.69 33.2,28.88 36.65,28.88 39.32,31.13 39.32,32.08 39.9,32.79 IC4.7
N$2  (via drill 0.51)
  Top 0.305: v10.16,15.88 11.8,15.88 LED2.A | v10.16,19.71 11.79,19.71 LED9.A | v10.16,31.12 11.8,31.12 LED30.A | v10.16,27.31 11.8,27.31 LED23.A | v10.16,23.5 11.8,23.5 LED16.A | v10.16,42.55 11.8,42.55 LED51.A 11.84,42.58 11.84,43.59 12.78,44.53 12.78,45.66 RN1.2 | v10.16,34.95 LED37.A
  Top 0.406: v10.16,38.74 11.82,38.74 LED44.A
  Bottom 0.305: v10.16,38.74 v10.16,34.95 v10.16,31.12 v10.16,27.31 v10.16,23.5 v10.16,19.71 v10.16,15.88
  Bottom 0.406: v10.16,42.55 v10.16,38.74
N$3
  Top 0.305: IC3.6 19.91,48.34 RN2.5
N$4  (via drill 0.51)
  Top 0.305: LED38.A v13.33,34.93 | LED31.A 13.33,31.12 v13.33,31.14 | LED24.A 13.33,27.31 v13.33,27.33 | LED17.A 13.33,23.5 v13.33,23.52 | LED10.A v13.33,19.69 | LED3.A v13.31,15.88 | RN1.3 13.56,42.77 v13.33,42.55
  Top 0.406: LED52.A 13.39,42.55 v13.33,42.55 | v13.33,38.74 15,38.76 LED45.A
  Bottom 0.305: v13.33,38.74 v13.33,34.93 v13.33,31.14 v13.33,27.33 v13.33,23.52 v13.33,19.69 13.33,15.88 v13.31,15.88
  Bottom 0.406: v13.33,42.55 v13.33,38.74
N$5  (via drill 0.51)
  Top 0.305: v16.51,42.57 16.51,42.55 LED53.A 18.19,42.58 18.21,43.26 17.5,43.74 15.49,43.87 14.36,45 RN1.4 14.35,45.67 | v16.54,38.74 18.16,38.74 LED46.A | LED39.A v16.54,34.93 | LED32.A 16.54,31.12 v16.54,31.14 | LED25.A v16.54,27.31 | LED18.A v16.54,23.5 | LED11.A v16.54,19.69 | LED4.A 16.54,15.88 v16.54,15.9
  Bottom 0.305: v16.51,42.57 16.54,42.57 v16.54,38.74 v16.54,34.93 v16.54,31.14 v16.54,27.31 v16.54,23.5 v16.54,19.69 v16.54,15.9
N$6
  Top 0.305: IC3.9 30.58,45.8 34.8,42.04 IC4.14
N$7
  Top 0.305: IC3.5 19.61,49.61 17.48,47.88 17.48,47.11 RN2.6
N$8
  Top 0.305: IC3.4 19.79,50.88 16.66,48.16 16.66,47.1 RN2.7
N$9
  Top 0.305: IC3.3 19.41,52.15 14.35,47.45 14.35,47.04 RN1.5
N$10
  Top 0.305: LED8.C LED9.C LED10.C LED11.C LED12.C LED13.C LED14.C 28.74,17.59 29.23,18.08 29.23,20.29 31.47,22.68 31.47,28.47 32.28,29.59 36.25,29.59 38.61,31.52 IC4.6
N$11
  Top 0.305: IC3.2 19.43,53.42 13.56,47.78 13.56,47.04 RN1.6
N$12
  Top 0.305: IC3.1 19.56,54.69 12.72,48.13 12.75,47.04 RN1.7
N$13
  Top 0.305: RN1.8 11.96,48.58 19.25,55.58 21.29,55.58 22.99,57.35 23.98,57.35 24.94,56.39 24.94,54.1 25.65,53.39 27.25,53.39 IC3.15
N$18
  Top 0.305: LED15.C LED16.C LED17.C LED18.C LED19.C LED20.C LED21.C 29.3,21.4 30.61,22.71 30.58,28.91 31.6,30.2 35.15,30.2 37.31,32 37.34,33.76 IC4.5
N$26
  Top 0.305: LED22.C LED23.C LED24.C LED25.C LED26.C LED27.C LED28.C 29.28,25.21 29.82,25.86 29.79,29.59 30.81,30.89 34.34,30.89 36.04,32.13 36.04,33.73 IC4.4
N$34
  Top 0.305: LED29.C LED30.C LED31.C LED32.C LED33.C LED34.C LED35.C 28.44,29.02 29.13,29.72 29.16,31.06 29.67,31.57 33.53,31.57 34.77,32.41 34.77,33.71 IC4.3
N$44
  Top 0.305: LED36.C LED37.C LED38.C LED39.C LED40.C LED41.C LED42.C 30.29,32.83 30.91,32.21 32.99,32.21 33.4,32.51 33.4,33.78 IC4.2
N$52
  Top 0.305: LED43.C LED44.C LED45.C LED46.C LED47.C LED48.C LED49.C
  Top 0.406: IC4.1 29.72,33.81 29.06,34.47 29.06,35.86 28.27,36.68 LED49.C
N$60
  Top 0.406: LED50.C LED51.C LED52.C LED53.C LED54.C LED55.C LED56.C 27.7,40.44 27.81,40.44 29.06,39.19 29.06,37.26 29.9,36.37 32.41,36.37 32.99,36.96 IC4.15
N$64  (via drill 0.51)
  Top 0.305: v19.71,42.57 19.71,42.55 LED54.A 21.34,42.67 20.68,43.33 19.28,43.33 17.83,44.43 17.82,44.42 16.94,44.48 16.66,44.75 16.66,45.71 RN2.2 | v19.71,38.74 21.34,38.74 LED47.A | LED40.A v19.71,34.93 | LED33.A 19.71,31.12 v19.71,31.14 | LED26.A v19.71,27.31 | LED19.A v19.71,23.5 | LED12.A v19.71,19.69 | LED5.A 19.71,15.88 v19.71,15.9
  Bottom 0.305: v19.71,42.57 v19.71,38.74 v19.71,34.93 v19.71,31.14 v19.71,27.31 v19.71,23.5 v19.71,19.69 v19.71,15.9
N$65  (via drill 0.51)
  Top 0.305: v22.86,42.57 22.81,42.55 LED55.A 24.51,43.36 23.9,43.97 19.56,43.97 18.36,44.92 18.27,44.98 17.58,45.01 17.42,45.16 17.42,45.71 RN2.3 | v22.86,38.76 24.51,38.76 LED48.A | LED41.A v22.86,34.93 | LED34.A v22.86,31.12 | LED27.A v22.86,27.31 | LED20.A v22.86,23.5 | LED13.A 22.86,19.69 v22.86,19.71 | LED6.A v22.86,15.88
  Bottom 0.305: v22.86,42.57 v22.86,38.76 v22.86,34.93 v22.86,31.12 v22.86,27.31 v22.86,23.5 v22.86,19.71 v22.86,15.88
N$66  (via drill 0.51)
  Top 0.305: v26.04,42.57 26.09,42.55 LED56.A 27.69,43.76 27,44.55 19.91,44.58 18.69,45.59 18.38,45.59 RN2.4 | v26.04,38.76 26.09,38.74 LED49.A | LED42.A 27.69,34.9 v26.04,34.9 | LED35.A 27.69,31.12 v26.04,31.12 | LED28.A 26.04,27.31 v26.04,27.33 | LED21.A v26.04,23.5 | LED14.A v26.04,19.69 | LED7.A 26.04,15.88 v26.04,15.9
  Bottom 0.305: v26.04,42.57 v26.04,38.76 v26.04,34.9 v26.04,31.12 v26.04,27.33 v26.04,23.5 v26.04,19.69 v26.04,15.9
N$67
  Top 0.305: 7.01,38.71 7.01,41.58 7.98,42.55 LED50.A 9.35,43.9 11.21,43.9 12.01,44.7 12.01,45.65 RN1.1 11.96,45.67 | 7.01,38.71 7.01,35.1 | 7.01,35.1 7.01,31.24 | 7.01,31.24 7.01,27.2 | 7.01,27.2 7.01,23.39 | 7.01,23.39 7.01,19.43 | 7.01,19.43 7.01,16.46 7.64,15.82 8.58,15.82 LED1.A | LED8.A 7.27,19.69 7.01,19.43 | LED15.A 7.12,23.5 7.01,23.39 | LED22.A 7.12,27.31 7.01,27.2 | LED29.A 7.13,31.12 7.01,31.24 | LED36.A 7.18,34.93 7.01,35.1 | LED43.A 7.04,38.74 7.01,38.71
  Top 0.406: 8.64,42.55 LED50.A
RD+
  Top 0.305: IC1.29 79.57,28.87 R7.1
RD-
  Top 0.305: IC1.30 80.49,29.67 R6.1
RESET  (via drill 0.51)  (1 unrouted)
  Top 0.305: D2.A 34.19,26.92 v33.45,23.65 33.45,22.33 30.79,19.66 30.79,16.89 29.84,16.03 29.84,9.48 RESET.3 | IC2.29 58.45,32.2 v56.24,32.26 | v48.56,31.6 43.94,31.62 ICSP.5
  Top 0.406: R4.1 v33.45,23.65
  Top 0.61: RESET.3 RESET.4
  Bottom 0.305: v66.83,23.7 64.75,23.7 57.45,30.99 57.51,30.99 v56.24,32.26 55.58,31.6 v48.56,31.6 | v33.45,23.65 39.34,23.65 39.93,24.21 44.04,24.21 45.03,25.2 45.03,29.16 ICSP.5
RESET2
  Top 0.305: IC1.24 76.48,23.27 D3.A 76.42,21.85 R3.1 78.4,22.1 ICSP1.5
SCK
  Top 0.406: ICSP.3 43.13,28.47 41.91,27.25 41.91,25.1 42.6,24.41 43.76,24.41 44.68,25.32 44.68,26.11 46.15,27.58 IC2.17
SCK2  (via drill 0.51)
  Top 0.305: IC1.15 68.54,26.47 68.22,26.16 68.22,23.29 67.89,22.96 67.89,17.27 68.86,16.31 v71.12,16.31
  Bottom 0.305: v71.12,16.31 71.35,16.31 75.59,20.83 82.17,20.83 ICSP1.3
STROBE  (via drill 0.51)
  Top 0.305: IC2.10 43.41,33.93 40.92,36.58 39.19,36.55 38.43,37.31 38.48,39.85 IC4.11 38.63,40.01 38.56,42.04 37.31,43.03 33.78,44.02 30.96,46.86 v30.96,47.47 30.1,48.34 IC3.11
  Bottom 0.305: v30.96,47.47 30.96,48.56 31.14,48.74 31.14,50.95 30.66,51.44 30.66,55.09 31.39,55.73 31.42,56.62 31.85,57.1 46.46,57.1 arc40 JP3.8
TP_VUCAP
  Top 0.305: 88.57,25.32 88.58,26.85 C8.1
  Top 0.406: IC1.27 78.9,27.27 79.12,27.05 79.12,24.77 79.7,24.13 87.3,24.13 88.57,25.32
UGND
  Top 0.305: X1.GND 87.3,41.45 85.65,41.45 84.25,40.23 84.3,37.31 87.17,35 87.17,28.83 | 88.3,29.24 C8.2 | GROUND.2 89.59,25.43 90.47,26.49 90.47,28.24 89.89,28.83 88.71,28.83 C8.2 | L1.1 81.86,24.92 85.9,24.92 87.17,26.19 87.17,28.83 | C8.2 88.64,28.83 87.17,28.83
  Top 0.406: IC1.28 79.32,28.07 79.81,27.58 79.81,26.44 80.01,26.24 L1.1
USHIELD
  Top 0.61: L1.2 84.86,26.24 86,27.38 86,29.61 Z1.2 Z2.2
XT1
  Top 0.406: IC1.1 76.48,35.35 R1.1 C9.1 79.49,38.6 Q1.1
XT2
  Top 0.406: IC1.2 75.69,35.48 R1.2 C11.1 72.91,38.34 Q1.2
XTAL1
  Top 0.305: Y2.3 49.49,39.58 50.29,39.22 50.29,38.3 50.75,37.85 51.92,37.85 52.5,37.16 IC2.7
XTAL2
  Top 0.305: Y2.1 49.72,37.61 50.32,37.24 51.33,37.24 51.66,36.86 51.66,36.24 IC2.8
XUSB
  Top 0.61: F2.1 82.45,46.51 X1.5V

### Text on the board
tNames: TX | RX | Cathodes | AD4/SDA | AD5/SCL | AD0 | AD1 | AD2 | AD3
bNames: Based on the Ardunio Uno Rev 3 / http://arduino.cc / / Designed by GR Makers. / http://grmakers.com/ / / Board layout by Mark Farver, / Twisted Blades LLC / http://www.twistedblades.net/ | CR2450
214bmp: D:/SmartProjects/Snc/a4_bn_logo2.bmp